# EasyEDA Pro project 通用F405飞控_2025-10-26.epro, schematic 主控

## Sheets
1 P1: Board Name: Board1; Create Date: 2025-10-18; Page Name: P1; Project Name: 通用F405飞控; Schematic Name: 主控; Update Date: 2025-10-23; Company: 嘉立创EDA; Page Size: A4; Version: V1.0
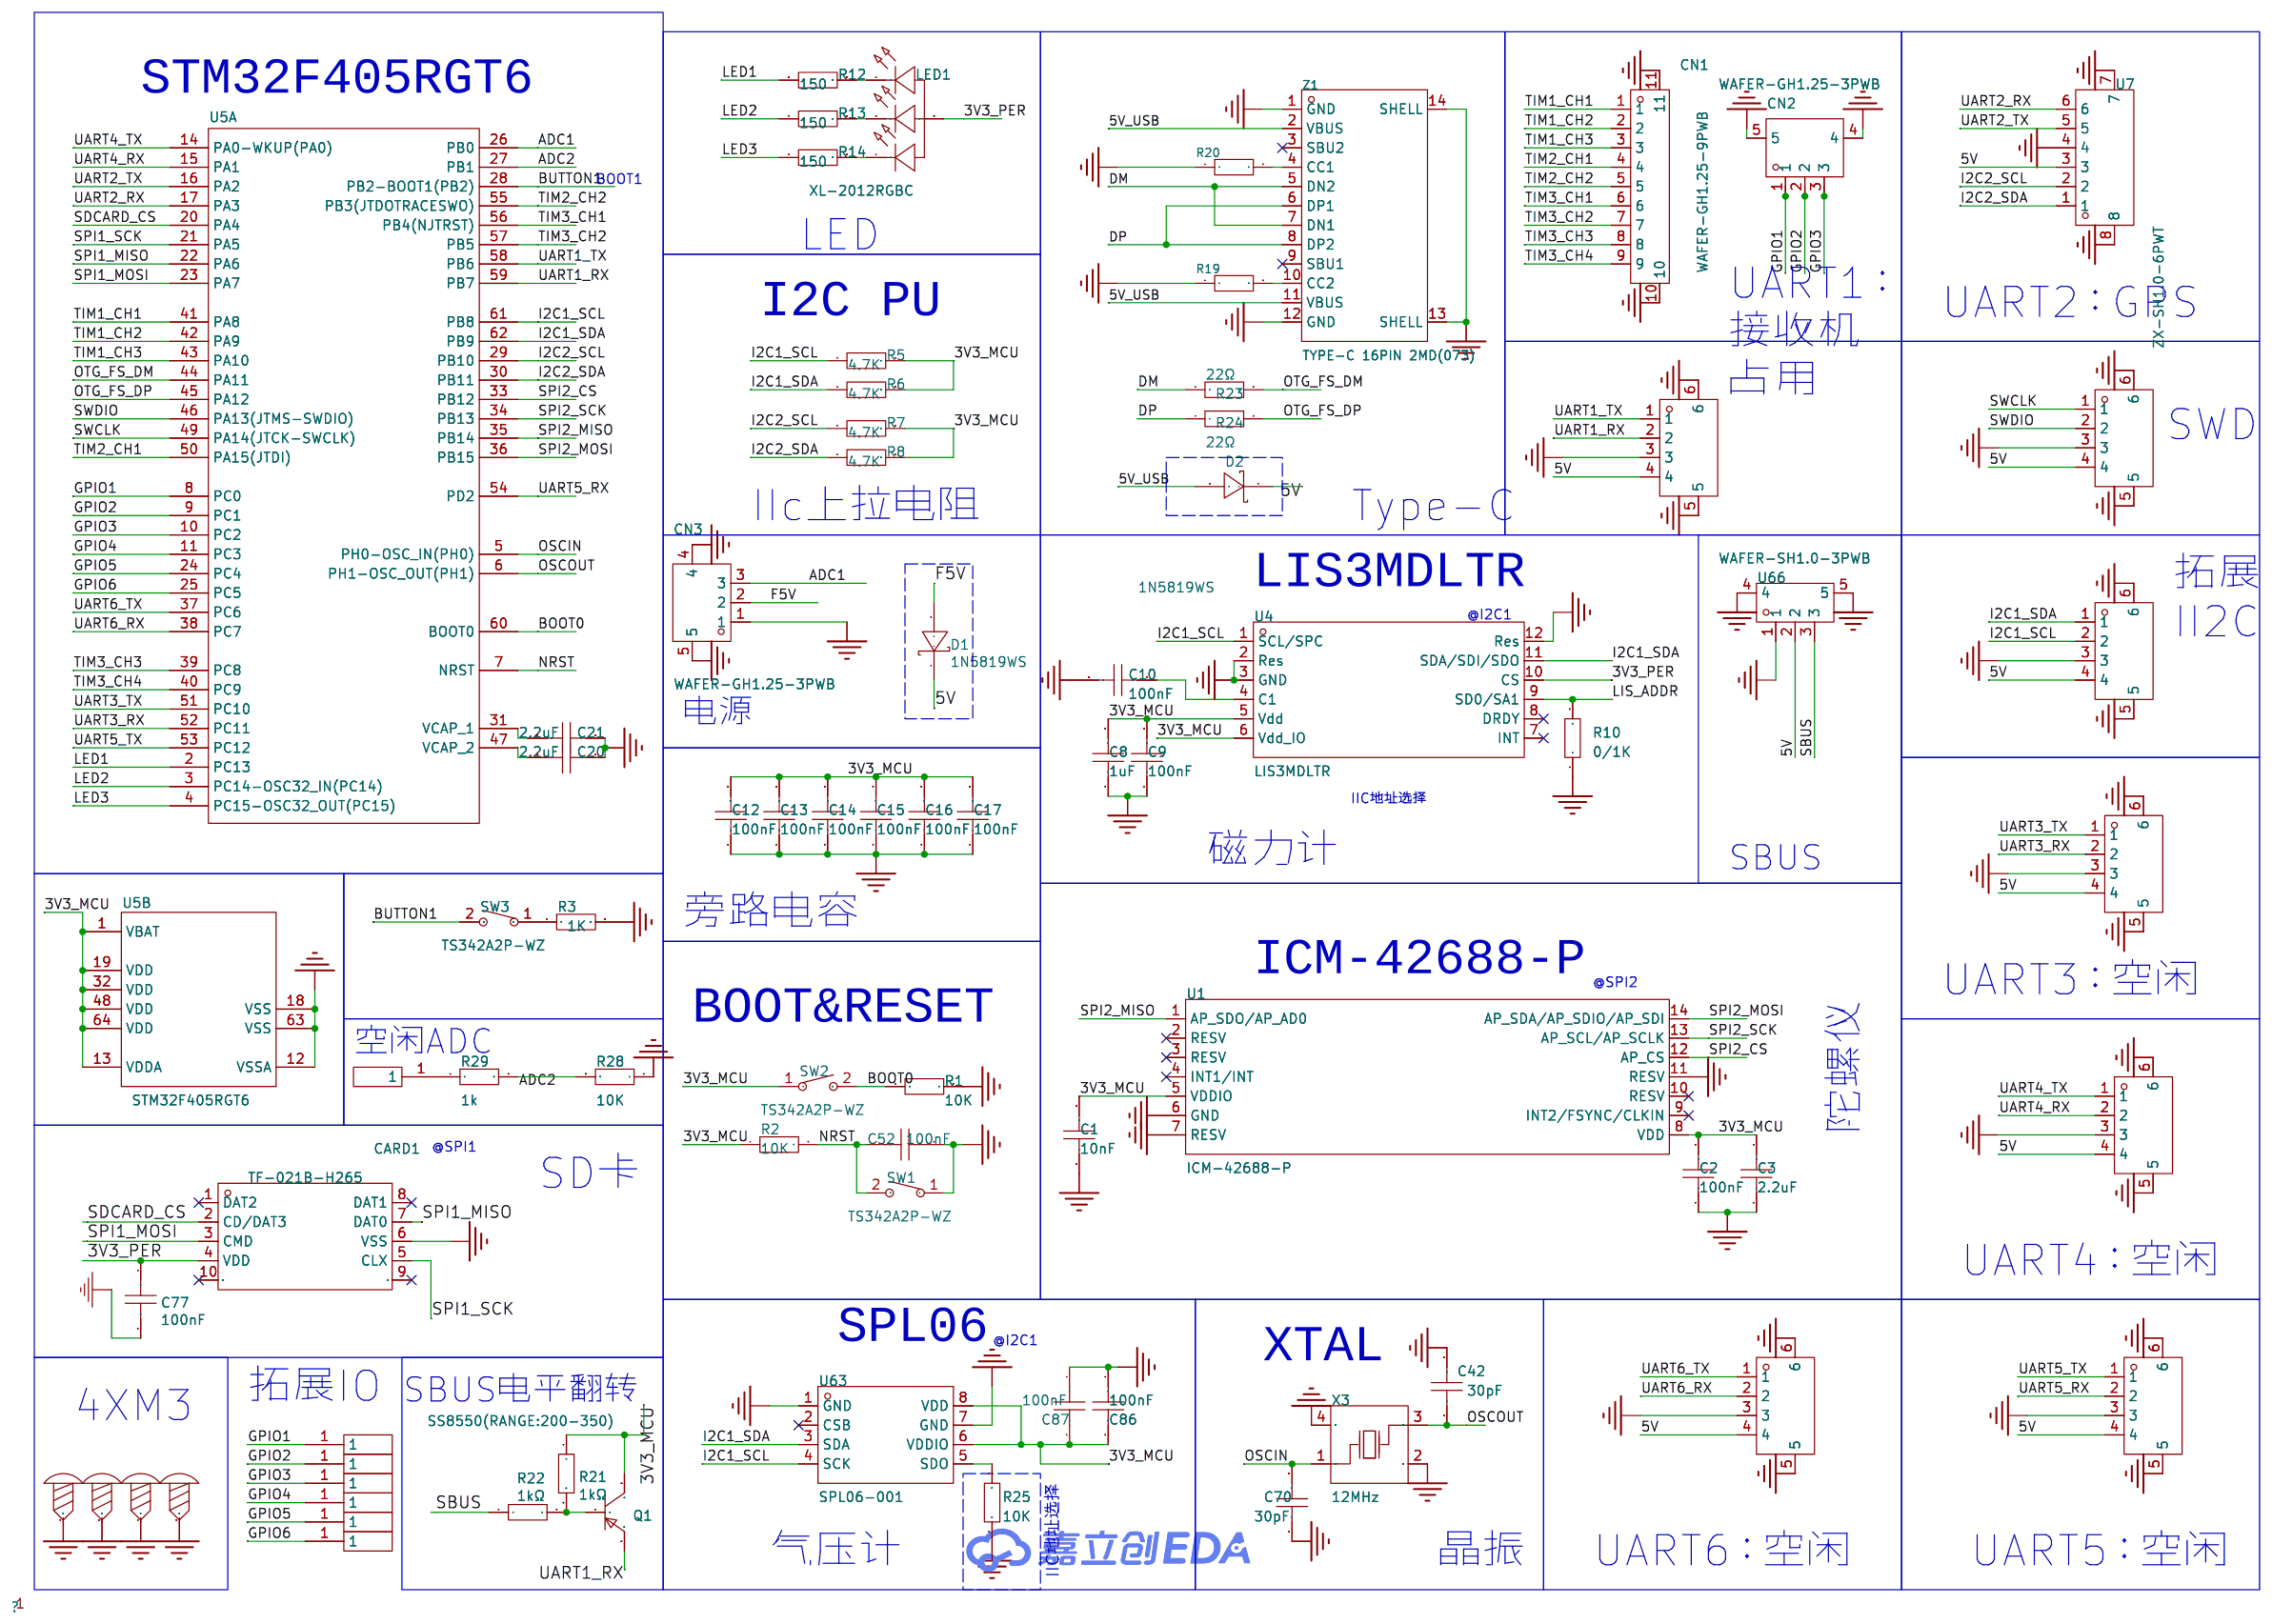
[diagram p1: P1]
2 P2: Create Date: 2025-10-19; Page Name: P2
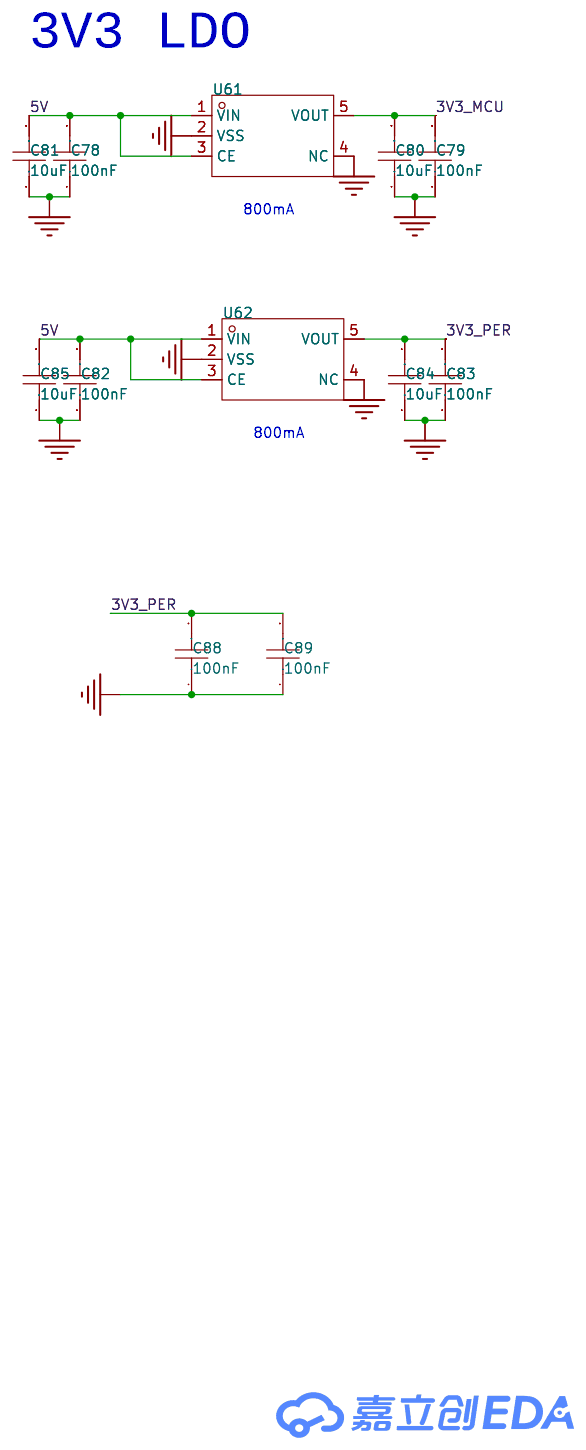
[diagram p2: P2]

## Parts
sheet P1
C1  10nF  [C0603]
C2  100nF  [C0603]
C3  2.2uF  [C0603]
C8  1uF  [C0603]
C9  100nF  [C0603]
C10  100nF  [C0603]
C12  100nF  [C0603]
C13  100nF  [C0603]
C14  100nF  [C0603]
C15  100nF  [C0603]
C16  100nF  [C0603]
C17  100nF  [C0603]
C20  2.2uF  [C0603]
C21  2.2uF  [C0603]
C42  30pF  [C0603]
C52  100nF  [C0603]
C70  30pF  [C0603]
C77  100nF  [C0603]
C86  100nF  [C0603]
C87  100nF  [C0603]
CARD1  TF-021B-H265  [TF-SMD_TF-021B-H265]
CN1  WAFER-GH1.25-9PWB  [CONN-SMD_9P-P1.25_XUNPU_WAFER-GH1.25-9PWB]
CN2  WAFER-GH1.25-3PWB  [CONN-TH_3P-P1.25_GH1.25]
CN3  WAFER-GH1.25-3PWB  [CONN-TH_3P-P1.25_GH1.25]
D1  1N5819WS  [SOD-323_L1.8-W1.3-LS2.5-RD]
D2  1N5819WS  [SOD-323_L1.8-W1.3-LS2.5-RD]
H3  -  [飞控微型焊盘]
H4  -  [飞控微型焊盘]
H5  -  [飞控微型焊盘]
H6  -  [飞控微型焊盘]
H11  -  [飞控微型焊盘]
H12  -  [飞控微型焊盘]
H13  -  [飞控微型焊盘]
LED1  XL-2012RGBC  [LED-SMD_4P-L2.0-W1.3-BR]
Q1  SS8550(RANGE:200-350)  [SOT-323-3_L2.0-W1.3-P1.30-LS2.1-BR]
R1  10K  [R0603]
R2  10K  [R0603]
R3  1K  [R0603]
R5  4.7K  [R0603]
R6  4.7K  [R0603]
R7  4.7K  [R0603]
R8  4.7K  [R0603]
R10  0/1K  [R0603]
R12  150  [R0603]
R13  150  [R0603]
R14  150  [R0603]
R19  5.1kΩ  [R0603]
R20  5.1kΩ  [R0603]
R21  1kΩ  [R0603]
R22  1kΩ  [R0603]
R23  22Ω  [R0603]
R24  22Ω  [R0603]
R25  10K  [R0603]
R28  10K  [R0603]
R29  10K  [R0603]
SCREW1  -  [M3螺丝]
SCREW2  -  [M3螺丝]
SCREW3  -  [M3螺丝]
SCREW4  -  [M3螺丝]
SW1  TS342A2P-WZ  [SW-SMD_L4.0-W2.9-LS5.0]
SW2  TS342A2P-WZ  [SW-SMD_L4.0-W2.9-LS5.0]
SW3  TS342A2P-WZ  [SW-SMD_L4.0-W2.9-LS5.0]
U1  ICM-42688-P  [LGA-14_L3.0-W2.5-P0.50-TL]
U4  LIS3MDLTR  [LGA-12_L2.0-W2.0-P0.50-BL]
U5  STM32F405RGT6  [LQFP-64_L10.0-W10.0-P0.50-LS12.0-BL]  (sections 1,2)
U7  ZX-SH1.0-6PWT  [CONN-SMD_6P-P1.00_MEGASTAR_ZX-SH1.0-6PWT]
U44  ZX-SH1.0-4PWT  [CONN-SMD_4P-P1.00_MEGASTAR_ZX-SH1.0-4PWT]
U45  ZX-SH1.0-4PWT  [CONN-SMD_4P-P1.00_MEGASTAR_ZX-SH1.0-4PWT]
U46  ZX-SH1.0-4PWT  [CONN-SMD_4P-P1.00_MEGASTAR_ZX-SH1.0-4PWT]
U49  ZX-SH1.0-4PWT  [CONN-SMD_4P-P1.00_MEGASTAR_ZX-SH1.0-4PWT]
U50  ZX-SH1.0-4PWT  [CONN-SMD_4P-P1.00_MEGASTAR_ZX-SH1.0-4PWT]
U59  ZX-SH1.0-4PWT  [CONN-SMD_4P-P1.00_MEGASTAR_ZX-SH1.0-4PWT]
U60  ZX-SH1.0-4PWT  [CONN-SMD_4P-P1.00_MEGASTAR_ZX-SH1.0-4PWT]
U63  SPL06-001  [SENSOR-SMD_SPL06-001]
U66  WAFER-SH1.0-3PWB  [CONN-SMD_3P-P1.00_WAFER-SH1.0-3PWB]
X3  12MHz  [CRYSTAL-SMD_4P-L3.2-W2.5-BL]
Z1  TYPE-C 16PIN 2MD(073)  [USB-C-SMD_TYPE-C-6PIN-2MD-073]
sheet P2
C78  100nF  [C0603]
C79  100nF  [C0603]
C80  10uF  [C0603]
C81  10uF  [C0603]
C82  100nF  [C0603]
C83  100nF  [C0603]
C84  10uF  [C0603]
C85  10uF  [C0603]
C88  100nF  [C0603]
C89  100nF  [C0603]
U61  ME6217C33M5G  [SOT-23-5_L3.0-W1.7-P0.95-LS2.8-BR]
U62  ME6217C33M5G  [SOT-23-5_L3.0-W1.7-P0.95-LS2.8-BR]

## Library data of the parts
C1-C3 C8-C10 C86 C87 = CAP_0603: Supplier Footprint: 0603
C12-C17 C52 C77-C79 C81-C83 C85 C88 C89 = CC0603KRX7R9BB104: 容值:100nF;精度:±10%;额定电压:50V;材质(温度系数):X7R;; LCSC Part Name: 100nF ±10% 50V; Supplier Part: C14663; Manufacturer: YAGEO(国巨); Supplier Footprint: 0603; JLCPCB Part Class: Basic Part; Datasheet: https://atta.szlcsc.com/upload/public/pdf/source/20180910/C282072_33301C7F631E79921B82A8DAC6BCC5B3.pdf; Supplier: LCSC; Tolerance: ±10%; Voltage Rated: 50V; Temperature Coefficient: X7R
C20 C21 = CL10A225KO8NNNC: 容值:2.2uF;精度:±10%;额定电压:16V;材质(温度系数):X5R;; LCSC Part Name: 2.2uF ±10% 16V; Supplier Part: C23630; Manufacturer: SAMSUNG(三星); Supplier Footprint: 0603; JLCPCB Part Class: Basic Part; Datasheet: https://atta.szlcsc.com/upload/public/pdf/source/20160218/1457707763339.pdf; Supplier: LCSC; Tolerance: ±10%; Voltage Rated: 16V; Temperature Coefficient: X5R
C42 C70 = 0603CG300J500NT: 容值:30pF;精度:±5%;额定电压:50V;材质(温度系数):C0G;; LCSC Part Name: 30pF ±5% 50V; Supplier Part: C1658; Manufacturer: FH(风华); Supplier Footprint: 0603; JLCPCB Part Class: Basic Part; Datasheet: https://atta.szlcsc.com/upload/public/pdf/source/20170923/C1658_1506149307366988446.pdf; Supplier: LCSC; Tolerance: ±5%; Voltage Rated: 50V; Temperature Coefficient: C0G
CARD1 = TF-021B-H265: 卡连接方式:拔插式;卡类型:MicroSD卡(TF卡);连接器类型:卡座;本体最大高度:2.5mm;工作温度范围:-25℃~+75℃;; LCSC Part Name: 拔插式 MicroSD卡(TF卡) 卡座; Supplier Part: C498185; Manufacturer: SOFNG(硕方); Supplier Footprint: SMD; JLCPCB Part Class: 扩展库; Datasheet: https://atta.szlcsc.com/upload/public/pdf/source/20200318/C498185_790264C8C4D0E25CCBD64FEBD13A33FF.pdf; Supplier: LCSC; Card Connection Mode: 拔插式; Card Type: MicroSD卡(TF卡); Connector Type: 卡座; Maximum Body Height: 2.5mm; Operating Temperature Range: -25℃~+75℃
CN1 = WAFER-GH1.25-9PWB: 插针结构:1x9P;间距:1.25mm;安装方式:卧贴;参考系列:GH;总PIN数:9P;排数:1;每排PIN数:9;行距:-;额定电流:1A;触头材质:黄铜;触头镀层:锡;工作温度:-25℃~+85℃;; LCSC Part Name: 1x9P 间距:1.25mm 卧贴 系列:GH; Supplier Part: C3029384; Manufacturer: XUNPU(讯普); Supplier Footprint: SMD,P=1.25mm,卧贴; JLCPCB Part Class: 扩展库; Datasheet: https://item.szlcsc.com/datasheet/WAFER-GH1.25-9PWB/3561396.html; Supplier: LCSC; Pins Structure: 1x9P; Pitch: 1.25mm; Mounting Type: 卧贴; Reference Series: GH; Number of Pins: 9P; Number of Rows: 1; Number of PINs Per Row: 9; Current Rating: 1A; Contact Material: 黄铜; Contact Plating: 锡; Operating Temperature: -25℃~+85℃; Voltage Rating: 125V; Plastic Material: LCP; Supplementary Features: 辅助焊脚; Color: 米色; Z-Height of the Board: 4.35mm; X-Length of Bottom Edge on Board (Spacing Line): 14.5mm; Y-Width of Bottom Edge on Board: 5mm
CN2 CN3 = WAFER-GH1.25-3PWB: 插针结构:1x3P;间距:1.25mm;安装方式:卧贴;参考系列:GH;总PIN数:3P;排数:1;每排PIN数:3;行距:-;额定电流:1A;触头材质:黄铜;触头镀层:锡;工作温度:-25℃~+85℃;; LCSC Part Name: 1x3P 间距:1.25mm 卧贴 系列:GH; Supplier Part: C3029378; Manufacturer: XUNPU(讯普); Supplier Footprint: SMD,P=1.25mm,卧贴; JLCPCB Part Class: 扩展库; Datasheet: https://item.szlcsc.com/datasheet/WAFER-GH1.25-3PWB/3561390.html; Supplier: LCSC; Pins Structure: 1x3P; Pitch: 1.25mm; Mounting Type: 卧贴; Reference Series: GH; Number of Pins: 3P; Number of Rows: 1; Number of PINs Per Row: 3; Current Rating: 1A; Contact Material: 黄铜; Contact Plating: 锡; Operating Temperature: -25℃~+85℃; Voltage Rating: 125V; Plastic Material: LCP; Supplementary Features: 辅助焊脚; Color: 米色; Z-Height of the Board: 4.35mm; X-Length of Bottom Edge on Board (Spacing Line): 7mm; Y-Width of Bottom Edge on Board: 5mm
D1 D2 = 1N5819WS_C191023: 正向压降(Vf):600mV@1A;直流反向耐压(Vr):40V;平均整流电流(Io):1A;; LCSC Part Name: 电压:40V 电流:1A; Supplier Part: C191023; Manufacturer: Hottech(合科泰); Supplier Footprint: SOD-323; JLCPCB Part Class: Basic Part; Datasheet: https://atta.szlcsc.com/upload/public/pdf/source/20220428/3CB86FD8D28D653594B4E35F9D5AEFD9.pdf; Supplier: LCSC; Forward Voltage (Vf@If): 600mV@1A; Reverse Voltage (Vr): 40V; Average Rectified Current (Io): 1A
H3-H6 H11-H13 = 飞控微型焊盘: 20250513 绘制接收机使用
LED1 = XL-2012RGBC: Supplier Part: C965848; Manufacturer: XINGLIGHT(成兴光); Supplier Footprint: 0805; JLCPCB Part Class: 扩展库; Datasheet: https://atta.szlcsc.com/upload/public/pdf/source/20250225/02226B7989ED21D7430AEF81656AA671.pdf; Supplier: LCSC; Diode Configuration: 共阳极; Viewing Angle: 120°; Lens Color: 无色透明透镜; Installation Method: 正贴; Operating Temperature: -30℃~+85℃
Q1 = SS8550(RANGE:200-350): 晶体管类型:PNP;集电极电流(Ic):1.5A;集射极击穿电压(Vceo):25V;功率(Pd):200mW;直流电流增益(hFE@Ic,Vce):200@800mA,1V;; LCSC Part Name: PNP 电流:1.5A 耐压:25V hfe:200-350; Supplier Part: C109069; Manufacturer: CJ(江苏长电/长晶); Supplier Footprint: SOT-323-3; JLCPCB Part Class: Extended Part; Datasheet: https://atta.szlcsc.com/upload/public/pdf/source/20170428/1493376770152.pdf; Supplier: LCSC; Transistor Type: PNP; Collector Current (Ic): 1.5A; Collector-Emitter Breakdown Voltage (Vceo): 25V; Power Dissipation (Pd): 200mW; DC Current Gain (hFE@Ic,Vce): 200@800mA,1V; Transition Frequency (fT): 100MHz; Collector Cut-Off Current (Icbo): 100nA; Collector-Emitter Saturation Voltage (VCE(sat)@Ic,Ib): 500mV@800mA,80mA; Operating Temperature: -55℃~+150℃
R1 R2 = 0603WAF1002T5E: 电阻类型:厚膜电阻;阻值:10kΩ;精度:±1%;功率:100mW;最大工作电压:75V;温度系数:±100ppm/℃;; LCSC Part Name: 厚膜电阻 10kΩ ±1% 100mW; Supplier Part: C25804; Manufacturer: UNI-ROYAL(厚声); Supplier Footprint: 0603; JLCPCB Part Class: Basic Part; Datasheet: https://atta.szlcsc.com/upload/public/pdf/source/20200306/C422600_1E6D84923E4A46A82E41ADD87F860B5C.pdf; Supplier: LCSC; Type: 厚膜电阻; Tolerance: ±1%; Power(Watts): 100mW; Overload Voltage (Max): 75V; Temperature Coefficient: ±100ppm/℃; Operating Temperature Range: -55℃~+155℃
R3 R10 R12-R14 R25 R28 R29 = Res_0603: Supplier Footprint: 0603
R5-R8 = 0603WAF4702T5E: 电阻类型:厚膜电阻;阻值:47kΩ;精度:±1%;功率:100mW;最大工作电压:75V;温度系数:±100ppm/℃;; LCSC Part Name: 47kΩ ±1% 100mW 厚膜电阻; Supplier Part: C25819; Manufacturer: UNI-ROYAL(厚声); Supplier Footprint: 0603; JLCPCB Part Class: Basic Part; Datasheet: https://atta.szlcsc.com/upload/public/pdf/source/20200306/C422600_1E6D84923E4A46A82E41ADD87F860B5C.pdf; Supplier: LCSC; Type: 厚膜电阻; Tolerance: ±1%; Power(Watts): 100mW; Overload Voltage (Max): 75V; Temperature Coefficient: ±100ppm/℃; Operating Temperature Range: -55℃~+155℃
R19 R20 = 0603WAF5101T5E: 电阻类型:厚膜电阻;阻值:5.1kΩ;精度:±1%;功率:100mW;最大工作电压:75V;温度系数:±100ppm/℃;; LCSC Part Name: 5.1kΩ ±1% 100mW 厚膜电阻; Supplier Part: C23186; Manufacturer: UNI-ROYAL(厚声); Supplier Footprint: 0603; JLCPCB Part Class: Basic Part; Datasheet: https://atta.szlcsc.com/upload/public/pdf/source/20200306/C422600_1E6D84923E4A46A82E41ADD87F860B5C.pdf; Supplier: LCSC; Type: 厚膜电阻; Tolerance: ±1%; Power(Watts): 100mW; Overload Voltage (Max): 75V; Temperature Coefficient: ±100ppm/℃; Operating Temperature Range: -55℃~+155℃; link: https://item.szlcsc.com/323315.html; 3DModel: R0402_L1.0-W0.5-H0.5; Resistance: 5.1K; Standardization Check: true
R21 R22 = 0603WAF1001T5E: 电阻类型:厚膜电阻;阻值:1kΩ;精度:±1%;功率:100mW;最大工作电压:75V;温度系数:±100ppm/℃;; LCSC Part Name: 1kΩ ±1% 100mW 厚膜电阻; Supplier Part: C21190; Manufacturer: UNI-ROYAL(厚声); Supplier Footprint: 0603; JLCPCB Part Class: Basic Part; Datasheet: https://atta.szlcsc.com/upload/public/pdf/source/20200306/C422600_1E6D84923E4A46A82E41ADD87F860B5C.pdf; Supplier: LCSC; Type: 厚膜电阻; Tolerance: ±1%; Power(Watts): 100mW; Overload Voltage (Max): 75V; Temperature Coefficient: ±100ppm/℃; Operating Temperature Range: -55℃~+155℃
R23 R24 = 0603WAF220JT5E: 电阻类型:厚膜电阻;阻值:22Ω;精度:±1%;功率:100mW;最大工作电压:75V;温度系数:±100ppm/℃;; LCSC Part Name: 22Ω ±1% 100mW 厚膜电阻; Supplier Part: C23345; Manufacturer: UNI-ROYAL(厚声); Supplier Footprint: 0603; JLCPCB Part Class: Basic Part; Datasheet: https://atta.szlcsc.com/upload/public/pdf/source/20200306/C422600_1E6D84923E4A46A82E41ADD87F860B5C.pdf; Supplier: LCSC; Type: 厚膜电阻; Tolerance: ±1%; Power(Watts): 100mW; Overload Voltage (Max): 75V; Temperature Coefficient: ±100ppm/℃; Operating Temperature Range: -55℃~+155℃
SCREW1-SCREW4 = M3螺丝: Supplier Footprint: 插件
SW1-SW3 = TS342A2P-WZ: 电路结构:单刀单掷;按钮形状:圆形按钮;安装方式:立贴;开关长度:3.95mm;开关宽度:2.9mm;开关高度:2mm;带支架:不带;触点电流:50mA;额定电压(DC):12V;绝缘电阻:100MΩ;机械寿命:3万次;; LCSC Part Name: 3.95*2.9*2mm 立贴 轻触开关; Supplier Part: C557591; Manufacturer: SHOU HAN(首韩); Supplier Footprint: SMD; JLCPCB Part Class: 扩展库; Datasheet: https://atta.szlcsc.com/upload/public/pdf/source/20200519/C557591_B3A5A21584733303F06306F18577DA8B.pdf; Supplier: LCSC; Circuit: 单刀单掷; Actuator Style: 圆形按钮; Mounting Style: 立贴; Switch Length: 3.95mm; Switch Width: 2.9mm; Switch Height: 2mm; Strike Gundam: 不带; Contact Current: 50mA; Voltage Rating (DC): 12V; Insulation Resistance: 100MΩ; Actuator/Cap Color: 黑色; Pin Style: SMD接片; Mechanical Life: 3万次; Operating Temperature: -25℃~+70℃
U1 = ICM-42688-P: 传感器类型:加速度计陀螺仪;; Supplier Part: C1850418; Manufacturer: TDK InvenSense(应美盛); Supplier Footprint: LGA-14(2.5x3); JLCPCB Part Class: 扩展库; Datasheet: https://atta.szlcsc.com/upload/public/pdf/source/20210703/CF24204867ACE5B754A2B035F23E5931.pdf; Supplier: LCSC; Sensor Type: 加速度计陀螺仪
U4 = LIS3MDLTR: 3轴MEMS磁场传感器，数字输出，I2C/SPI，低功耗模式，高性能; LCSC Part Name: 三轴数字磁传感器; Supplier Part: C478483; Manufacturer: ST(意法半导体); Supplier Footprint: LGA-12(2x2); JLCPCB Part Class: 扩展库; Datasheet: https://atta.szlcsc.com/upload/public/pdf/source/20191231/C478483_325C07DDDEF2D93C2E541FB70AD6AC5C.pdf; Supplier: LCSC
U5 = STM32F405RGT6: CPU内核:ARM Cortex-M4;CPU最大主频:168MHz;工作电压范围:1.8V~3.6V;内部振荡器:有;程序 FLASH容量:1MB;RAM总容量:192KB;EEPROM/数据 FLASH容量:-;GPIO端口数量:51;ADC(单元数/通道数/位数):1@x16ch/12bit;DAC(单元数/通道数/位数):1@x2ch/12bit;外设/功能/协议栈:欠压检测/复位；DMA；LCD驱动；看门狗；POR；PWM;工作温度范围:-40℃~+85℃;; LCSC Part Name: ARM Cortex-M4 168MHz 闪存：1MB RAM：192KB; Supplier Part: C15742; Manufacturer: ST(意法半导体); Supplier Footprint: LQFP-64(10x10); JLCPCB Part Class: 扩展库; Datasheet: https://atta.szlcsc.com/upload/public/pdf/source/20140724/1457707160365.pdf; Supplier: LCSC; CPU Core: ARM Cortex-M4; CPU Maximum Speed: 168MHz; Operating Voltage Range: 1.8V~3.6V; Program Storage Size: 1MB; Program Memory Type: FLASH; RAM Size: 192KB; GPIO Ports Number: 51; ADC (Bit): 12bit; DAC (Bit): 12bit; Universal Serial Bus: 有; Peripheral/Function: DMA；LCD/LED驱动；PWM; Watchdog: 有; Infrared Data Association: 有; Low-Voltage Detect: 有; LCD Module: 有; Direct Memory Access: 有; Internal Oscillator: 有; Operating Temperature Range: -40℃~+85℃; Maximum Frequency: 168MHz; Supply Voltage Range: 1.8V~3.6V; Program FLASH Size: 1MB; ADC (Units/Channels/bits): 1@x16ch/12bit; DAC (Units/Channels/bits): 1@x2ch/12bit; Peripherals / Functions / Protocol Stacks: 欠压检测/复位；DMA；LCD驱动；看门狗；POR；PWM
U7 = ZX-SH1.0-6PWT: 插针结构:1x6P;间距:1mm;安装方式:卧贴;参考系列:SH;总PIN数:6P;排数:1;每排PIN数:6;行距:-;额定电流:-;触头材质:黄铜;触头镀层:锡;工作温度范围:-;; LCSC Part Name: 1x6P 间距:1mm 卧贴 系列:SH; Supplier Part: C7430448; Manufacturer: Megastar(兆星); Supplier Footprint: SMD,P=1mm,卧贴; JLCPCB Part Class: 扩展库; Datasheet: https://atta.szlcsc.com/upload/public/pdf/source/20230619/677B156B919545DC550B043554513491.pdf; Supplier: LCSC; Pins Structure: 1x6P; Pitch: 1mm; Mounting Style: 卧贴; Reference Series: SH; Number of Pins: 6P; Number of Rows: 1; Number of PINs Per Row: 6; Contact Material: 黄铜; Contact Plating: 锡; Supplementary Features: 辅助焊脚; Colour: 米色; Z-Height of the Board: 3.15mm; X-Length of Bottom Edge on Board (Spacing Line): 8.35mm; Y-Width of Bottom Edge on Board: 5.05mm
U44-U46 U49 U50 U59 U60 = ZX-SH1.0-4PWT: 插针结构:1x4P;间距:1mm;安装方式:卧贴;参考系列:SH;总PIN数:4P;排数:1;每排PIN数:4;行距:-;额定电流:-;触头材质:黄铜;触头镀层:锡;工作温度范围:-;; LCSC Part Name: 1x4P 间距:1mm 卧贴 系列:SH; Supplier Part: C7430446; Manufacturer: Megastar(兆星); Supplier Footprint: SMD,P=1mm,卧贴; JLCPCB Part Class: 扩展库; Datasheet: https://atta.szlcsc.com/upload/public/pdf/source/20230619/390816C24B7A0EB1D042395C380CEA99.pdf; Supplier: LCSC; Pins Structure: 1x4P; Pitch: 1mm; Mounting Style: 卧贴; Reference Series: SH; Number of Pins: 4P; Number of Rows: 1; Number of PINs Per Row: 4; Contact Material: 黄铜; Contact Plating: 锡; Supplementary Features: 辅助焊脚; Colour: 米色; Z-Height of the Board: 3.15mm; X-Length of Bottom Edge on Board (Spacing Line): 6.35mm; Y-Width of Bottom Edge on Board: 5.05mm
U63 = SPL06-001: Supplier Part: C9900020778; Supplier Footprint: LGA8; JLCPCB Part Class: 扩展库; Supplier: LCSC
U66 = WAFER-SH1.0-3PWB: 插针结构:1x3P;间距:1mm;安装方式:卧贴;参考系列:SH;总PIN数:3P;排数:1;每排PIN数:3;行距:-;额定电流:1A;触头材质:黄铜;触头镀层:锡;工作温度:-40℃~+85℃;; LCSC Part Name: 1x3P 间距:1mm 卧贴 系列:SH; Supplier Part: C3029342; Manufacturer: XUNPU(讯普); Supplier Footprint: SMD,P=1mm,卧贴; JLCPCB Part Class: 扩展库; Datasheet: https://item.szlcsc.com/datasheet/WAFER-SH1.0-3PWB/3561354.html; Supplier: LCSC; Pins Structure: 1x3P; Pitch: 1mm; Mounting Type: 卧贴; Reference Series: SH; Number of Pins: 3P; Number of Rows: 1; Number of PINs Per Row: 3; Current Rating: 1A; Contact Material: 黄铜; Contact Plating: 锡; Operating Temperature: -40℃~+85℃; Voltage Rating: 50V; Plastic Material: LCP; Supplementary Features: 辅助焊脚; Color: 米色; Z-Height of the Board: 3.15mm; X-Length of Bottom Edge on Board (Spacing Line): 5.35mm; Y-Width of Bottom Edge on Board: 4.3mm
X3 = X322512MSB4SI: 晶振类型:贴片晶振;频率:12MHz;常温频差:±10ppm;外接负载电容:20pF;频率稳定度(全温):±20ppm;; LCSC Part Name: 12MHz ±10ppm 20pF; Supplier Part: C9002; Manufacturer: YXC(扬兴晶振); Supplier Footprint: SMD3225-4P; JLCPCB Part Class: 基础库; Datasheet: https://atta.szlcsc.com/upload/public/pdf/source/20240329/19D5F850207469550BEB00D7DFEDBC7A.pdf; Supplier: LCSC; Crystal Type: 贴片晶振; Normal temperature Frequency Tolerance: ±10ppm; External load capacitor: 20pF; Frequency Stability(Full temperature range): ±20ppm; Operating Temperature: -40℃~+85℃
Z1 = TYPE-C 16PIN 2MD(073): 连接器类型:Type-C;标准:-;公母:母座;触点数量:16;端口数量:1;安装方式:卧贴;额定电流 - 电源:5A;工作温度范围:-25℃~+85℃;; LCSC Part Name: TYPE-C母座 16P 4脚插件带定位柱 不锈钢外壳 2次模顶; Supplier Part: C2765186; Manufacturer: SHOU HAN(首韩); Supplier Footprint: SMD; JLCPCB Part Class: 扩展库; Supplier: LCSC; Connector Type: Type-C; Gender: 母座; Number of Contacts: 16; Number of Ports: 1; Mounting Style: 卧贴; Current Rating - Power (Max): 5A; Operating Temperature Range: -25℃~+85℃
C80 C84 = CL10A106KP8NNNC: 容值:10uF;精度:±10%;额定电压:10V;材质(温度系数):X5R;; LCSC Part Name: 10uF ±10% 10V; Supplier Part: C19702; Manufacturer: SAMSUNG(三星); Supplier Footprint: 0603; JLCPCB Part Class: Basic Part; Datasheet: https://atta.szlcsc.com/upload/public/pdf/source/20160218/1457707763339.pdf; Supplier: LCSC; Tolerance: ±10%; Voltage Rated: 10V; Temperature Coefficient: X5R
U61 U62 = ME6217C33M5G: 输出类型:固定;输出极性:正;最大输入电压:7V;输出电压:3.3V;输出电流:800mA;电源纹波抑制比(PSRR):65dB@(1kHz);; Supplier Part: C427602; Manufacturer: MICRONE(南京微盟); Supplier Footprint: SOT-23-5; JLCPCB Part Class: 扩展库; Datasheet: https://atta.szlcsc.com/upload/public/pdf/source/20190910/C427602_D4B9162A2E9D9EF57C60010DFDECEF37.pdf; Supplier: LCSC; Output Type: 固定; Output Polarity: 正; Number of Outputs: 1; Maximum Input Voltage: 7V; Output Voltage: 3.3V; Dropout Voltage: 180mV@(300mA); Output Current: 800mA; Power Supply Rejection Ratio (PSRR): 65dB@(1kHz)

## Nets
3V3_MCU: C1.2 C2.2 C3.2 C8.2 C9.2 C12.2 C13.2 C14.2 C15.2 C16.2 C17.2 C79.2 C80.2 C86.2 C87.2 Q1.3 R2.1 R5.2 R6.2 R7.2 R8.2 R21.1 SW2.1 U1.5(VDDIO) U1.8(VDD) U4.5(Vdd) U4.6(Vdd_IO) U5.1(VBAT) U5.13(VDDA) U5.19(VDD) U5.32(VDD) U5.48(VDD) U5.64(VDD) U61.5(VOUT) U63.6(VDDIO) U63.8(VDD)
3V3_PER: C77.1 C83.2 C84.2 C88.2 C89.2 CARD1.4(VDD) LED1.3 U4.10(CS) U62.5(VOUT)
5V: C78.2 C81.2 C82.2 C85.2 D1.1(K) D2.1(K) U7.3 U44.4 U45.4 U46.4 U49.4 U50.4 U59.4 U60.4 U61.1(VIN) U61.3(CE) U62.1(VIN) U62.3(CE) U66.2
5V_USB: D2.2(A) Z1.2(VBUS) Z1.11(VBUS)
GND: C1.1 C2.1 C3.1 C8.1 C9.1 C10.1 C12.1 C13.1 C14.1 C15.1 C16.1 C17.1 C20.1 C21.1 C42.2 C52.2 C70.1 C77.2 C78.1 C79.1 C80.1 C81.1 C82.1 C83.1 C84.1 C85.1 C86.1 C87.1 C88.1 C89.1 CARD1.6(VSS) CN1.10 CN1.11 CN2.4 CN2.5 CN3.1 CN3.4 CN3.5 R1.2 R3.2 R10.1 R19.1 R20.1 R25.1 R28.1 SCREW1.1 SCREW2.1 SCREW3.1 SCREW4.1 SW1.1 U1.6(GND) U1.7(RESV) U1.11(RESV) U4.2(Res) U4.3(GND) U4.12(Res) U5.12(VSSA) U5.18(VSS) U5.63(VSS) U7.4 U7.7 U7.8 U44.3 U44.5 U44.6 U45.3 U45.5 U45.6 U46.3 U46.5 U46.6 U49.3 U49.5 U49.6 U50.3 U50.5 U50.6 U59.3 U59.5 U59.6 U60.3 U60.5 U60.6 U61.2(VSS) U61.4(NC) U62.2(VSS) U62.4(NC) U63.1(GND) U63.7(GND) U66.1 U66.4 U66.5 X3.2(GND) X3.4(GND) Z1.1(GND) Z1.12(GND) Z1.13(SHELL) Z1.14(SHELL)
ADC1: CN3.3 U5.26(PB0)
ADC2: R28.2 R29.2 U5.27(PB1)
BOOT0: R1.1 SW2.2 U5.60(BOOT0)
BUTTON1: SW3.2 U5.28(PB2-BOOT1(PB2))
DM: R23.1 Z1.5(DN2) Z1.7(DN1)
DP: R24.1 Z1.6(DP1) Z1.8(DP2)
F5V: CN3.2 D1.2(A)
GPIO1: CN2.1 H3.1 U5.8(PC0)
GPIO2: CN2.2 H4.1 U5.9(PC1)
GPIO3: CN2.3 H5.1 U5.10(PC2)
GPIO4: H6.1 U5.11(PC3)
GPIO5: H11.1 U5.24(PC4)
GPIO6: H12.1 U5.25(PC5)
I2C1_SCL: R5.1 U4.1(SCL/SPC) U5.61(PB8) U45.2 U63.4(SCK)
I2C1_SDA: R6.1 U4.11(SDA/SDI/SDO) U5.62(PB9) U45.1 U63.3(SDA)
I2C2_SCL: R7.1 U5.29(PB10) U7.2
I2C2_SDA: R8.1 U5.30(PB11) U7.1
LED1: R12.1 U5.2(PC13)
LED2: R13.1 U5.3(PC14-OSC32_IN(PC14))
LED3: R14.1 U5.4(PC15-OSC32_OUT(PC15))
LIS_ADDR: R10.2 U4.9(SD0/SA1)
NRST: C52.1 R2.2 SW1.2 U5.7(NRST)
OSCIN: C70.2 U5.5(PH0-OSC_IN(PH0)) X3.1(OSC1)
OSCOUT: C42.1 U5.6(PH1-OSC_OUT(PH1)) X3.3(OSC2)
OTG_FS_DM: R23.2 U5.44(PA11)
OTG_FS_DP: R24.2 U5.45(PA12)
SBUS: R22.1 U66.3
SDCARD_CS: CARD1.2(CD/DAT3) U5.20(PA4)
SPI1_MISO: CARD1.7(DAT0) U5.22(PA6)
SPI1_MOSI: CARD1.3(CMD) U5.23(PA7)
SPI1_SCK: CARD1.5(CLX) U5.21(PA5)
SPI2_CS: U1.12(AP_CS) U5.33(PB12)
SPI2_MISO: U1.1(AP_SDO/AP_AD0) U5.35(PB14)
SPI2_MOSI: U1.14(AP_SDA/AP_SDIO/AP_SDI) U5.36(PB15)
SPI2_SCK: U1.13(AP_SCL/AP_SCLK) U5.34(PB13)
SWCLK: U5.49(PA14(JTCK-SWCLK)) U44.1
SWDIO: U5.46(PA13(JTMS-SWDIO)) U44.2
TIM1_CH1: CN1.1 U5.41(PA8)
TIM1_CH2: CN1.2 U5.42(PA9)
TIM1_CH3: CN1.3 U5.43(PA10)
TIM2_CH1: CN1.4 U5.50(PA15(JTDI))
TIM2_CH2: CN1.5 U5.55(PB3(JTDOTRACESWO))
TIM3_CH1: CN1.6 U5.56(PB4(NJTRST))
TIM3_CH2: CN1.7 U5.57(PB5)
TIM3_CH3: CN1.8 U5.39(PC8)
TIM3_CH4: CN1.9 U5.40(PC9)
UART1_RX: Q1.2 U5.59(PB7) U49.2
UART1_TX: U5.58(PB6) U49.1
UART2_RX: U5.17(PA3) U7.6
UART2_TX: U5.16(PA2) U7.5
UART3_RX: U5.52(PC11) U50.2
UART3_TX: U5.51(PC10) U50.1
UART4_RX: U5.15(PA1) U46.2
UART4_TX: U5.14(PA0-WKUP(PA0)) U46.1
UART5_RX: U5.54(PD2) U60.2
UART5_TX: U5.53(PC12) U60.1
UART6_RX: U5.38(PC7) U59.2
UART6_TX: U5.37(PC6) U59.1
$1N2558: C10.2 U4.4(C1)
$1N22340: C20.2 U5.47(VCAP_2)
$1N22341: C21.2 U5.31(VCAP_1)
$1N24539: R3.1 SW3.1
$1N24972: LED1.1 R12.2
$1N24975: LED1.2 R13.2
$1N24978: LED1.4 R14.2
Net-(H13-1): H13.1 R29.1
Net-(Q1-1): Q1.1 R21.2 R22.2
Net-(R19-2): R19.2 Z1.10(CC2)
Net-(R20-2): R20.2 Z1.4(CC1)
Net-(R25-2): R25.2 U63.5(SDO)

Not connected (* = marked no-connect by the designer): CARD1 1(DAT2)* 8(DAT1)* 9* 10*; U1 2(RESV)* 3(RESV)* 4(INT1/INT)* 9(INT2/FSYNC/CLKIN)* 10(RESV)*; U4 7(INT)* 8(DRDY)*; U63 2(CSB)*; Z1 3(SBU2)* 9(SBU1)*

## Notes on the sheets
sheet 1
- STM32F405RGT6
- BOOT1
- LED
- I2C PU
- UART2：GPS
- UART1：
  接收机
  占用
- SWD
- IIc上拉电阻
- Type-C
- LIS3MDLTR
- @I2C1
- 拓展
  II2C
- 电源
- IIC地址选择
- 磁力计
- SBUS
- 旁路电容
- ICM-42688-P
- @SPI2
- UART3：空闲
- BOOT&RESET
- 空闲ADC
- 陀螺仪
- @SPI1
- SD卡
- UART4：空闲
- @I2C1
- SPL06
- XTAL
- 拓展IO
- SBUS电平翻转
- 4XM3
- 气压计
- 晶振
- UART6：空闲
- UART5：空闲
- IIC地址选择
sheet 2
- 3V3 LDO
- 800mA
- 800mA
